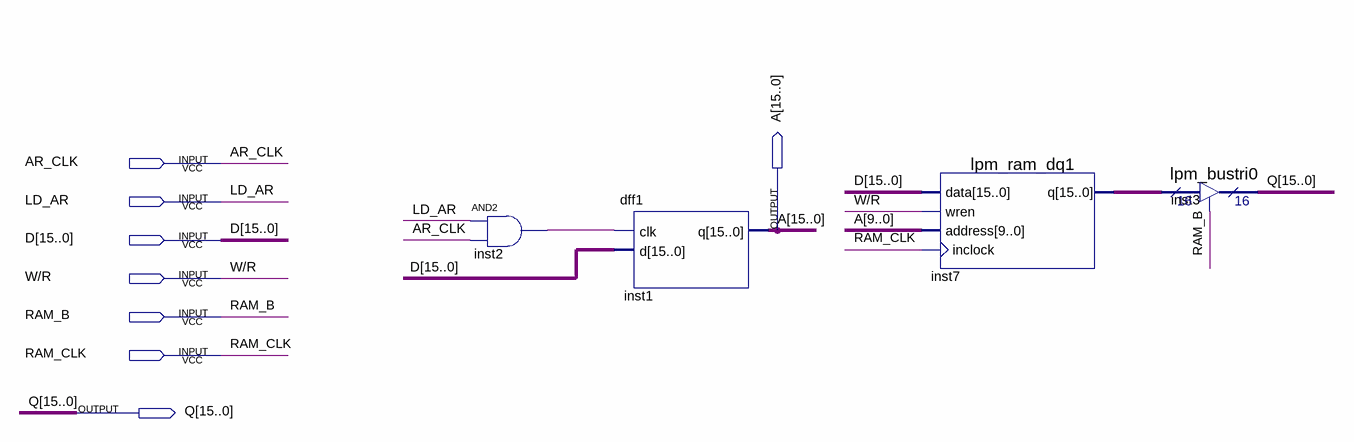
[diagram p0: schematic sheet]
// Quartus schematic ram.bdf as structural Verilog: 4 symbols, 8 pins
module ram (
  input  AR_CLK,
  input  LD_AR,
  input  [15:0] D,
  input  \W/R ,
  input  RAM_B,
  input  RAM_CLK,
  output [15:0] A,
  output [15:0] Q
);

  wire inst2_out;
  wire [15:0] inst7_q;

  and inst2 (inst2_out, LD_AR, AR_CLK);
  dff1 inst1 (.clk(inst2_out), .d(D), .q(A));
  lpm_ram_dq1 inst7 (.data(D), .wren(\W/R ), .address(A[9:0]), .inclock(RAM_CLK), .q(inst7_q));
  lpm_bustri0 inst3 (.enabledt(RAM_B), .data(inst7_q), .tridata(Q));
endmodule
